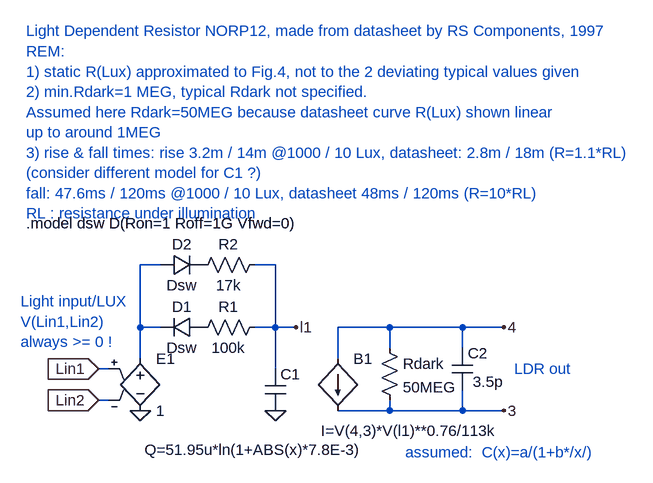
[diagram p0: schematic norp12.asc]
norp12.asc, the LTspice schematic file:
Version 4
SHEET 1 880 680
WIRE -192 208 -208 208
WIRE -192 256 -208 256
WIRE -144 144 -144 48
WIRE -144 192 -144 144
WIRE -112 48 -144 48
WIRE -112 144 -144 144
WIRE 64 48 32 48
WIRE 64 144 32 144
WIRE 64 144 64 48
WIRE 64 208 64 144
WIRE 96 144 64 144
WIRE 160 192 160 144
WIRE 240 144 160 144
WIRE 240 176 240 144
WIRE 240 272 160 272
WIRE 240 272 240 256
WIRE 352 144 240 144
WIRE 352 176 352 144
WIRE 352 272 240 272
WIRE 352 272 352 240
WIRE 416 144 352 144
WIRE 416 272 352 272
FLAG -144 272 0
FLAG 96 144 l1
FLAG -208 208 Lin1
IOPIN -208 208 In
FLAG 64 272 0
FLAG 416 144 4
FLAG -208 256 Lin2
IOPIN -208 256 In
FLAG 416 272 3
SYMBOL bi 160 192 R0
WINDOW 3 -26 111 Left 0
SYMATTR Value I=V(4,3)*V(l1)**0.76/113k
SYMATTR InstName B1
SYMBOL e -144 176 R0
SYMATTR InstName E1
SYMATTR Value 1
SYMBOL res 224 160 R0
SYMATTR InstName Rdark
SYMATTR Value 50MEG
SYMBOL res -64 160 R270
WINDOW 0 32 56 VTop 0
WINDOW 3 0 56 VBottom 0
SYMATTR InstName R1
SYMATTR Value 100k
SYMBOL cap 48 208 R0
WINDOW 3 -185 124 Left 0
SYMATTR Value Q=51.95u*ln(1+ABS(x)*7.8E-3)
SYMATTR InstName C1
SYMBOL cap 336 176 R0
WINDOW 3 32 52 Left 0
SYMATTR Value 3.5p
SYMATTR InstName C2
SYMBOL diode -48 128 R90
WINDOW 0 0 32 VBottom 0
WINDOW 3 32 32 VTop 0
SYMATTR InstName D1
SYMATTR Value Dsw
SYMBOL res -64 64 R270
WINDOW 0 32 56 VTop 0
WINDOW 3 0 56 VBottom 0
SYMATTR InstName R2
SYMATTR Value 17k
SYMBOL diode -112 64 R270
WINDOW 0 32 32 VTop 0
WINDOW 3 0 32 VBottom 0
SYMATTR InstName D2
SYMATTR Value Dsw
TEXT -328 104 Left 0 ;Light input/LUX\nV(Lin1,Lin2)\nalways >= 0 !
TEXT 432 208 Left 0 ;LDR out
TEXT -320 -312 Left 0 ;Light Dependent Resistor NORP12, made from datasheet by RS Components, 1997\nREM:\n1) static R(Lux) approximated to Fig.4, not to the 2 deviating typical values given\n2) min.Rdark=1 MEG, typical Rdark not specified.\nAssumed here Rdark=50MEG because datasheet curve R(Lux) shown linear\nup to around 1MEG\n3) rise & fall times: rise 3.2m / 14m @1000 / 10 Lux, datasheet: 2.8m / 18m (R=1.1*RL)\n(consider different model for C1 ?)\nfall: 47.6ms / 120ms @1000 / 10 Lux, datasheet 48ms / 120ms (R=10*RL)\nRL : resistance under illumination
TEXT -320 -16 Left 0 !.model dsw D(Ron=1 Roff=1G Vfwd=0)
TEXT 264 336 Left 0 ;assumed:  C(x)=a/(1+b*/x/)

The netlist it stands for:
* norp12.asc
B1 4 3 I=V(4,3)*V(l1)**0.76/113k
E1 N001 0 Lin1 Lin2 1
Rdark 4 3 50MEG
R1 P001 l1 100k
C1 l1 0 Q=51.95u*ln(1+ABS(x)*7.8E-3)
C2 4 3 3.5p
D1 P001 N001 Dsw
R2 P002 l1 17k
D2 N001 P002 Dsw
.model D D
.lib standard.dio
* Light input/LUX
* V(Lin1,Lin2)
* always >= 0 !
* LDR out
* Light Dependent Resistor NORP12, made from datasheet by RS Components, 1997
* REM:
* 1) static R(Lux) approximated to Fig.4, not to the 2 deviating typical values given
* 2) min.Rdark=1 MEG, typical Rdark not specified.
* Assumed here Rdark=50MEG because datasheet curve R(Lux) shown linear
* up to around 1MEG
* 3) rise & fall times: rise 3.2m / 14m @1000 / 10 Lux, datasheet: 2.8m / 18m (R=1.1*RL)
* (consider different model for C1 ?)
* fall: 47.6ms / 120ms @1000 / 10 Lux, datasheet 48ms / 120ms (R=10*RL)
* RL : resistance under illumination
.model dsw D(Ron=1 Roff=1G Vfwd=0)
* assumed:  C(x)=a/(1+b*/x/)
.backanno
.end